# EAGLE design 362_MiniProj_FullBoard (EAGLE 7.5.0)
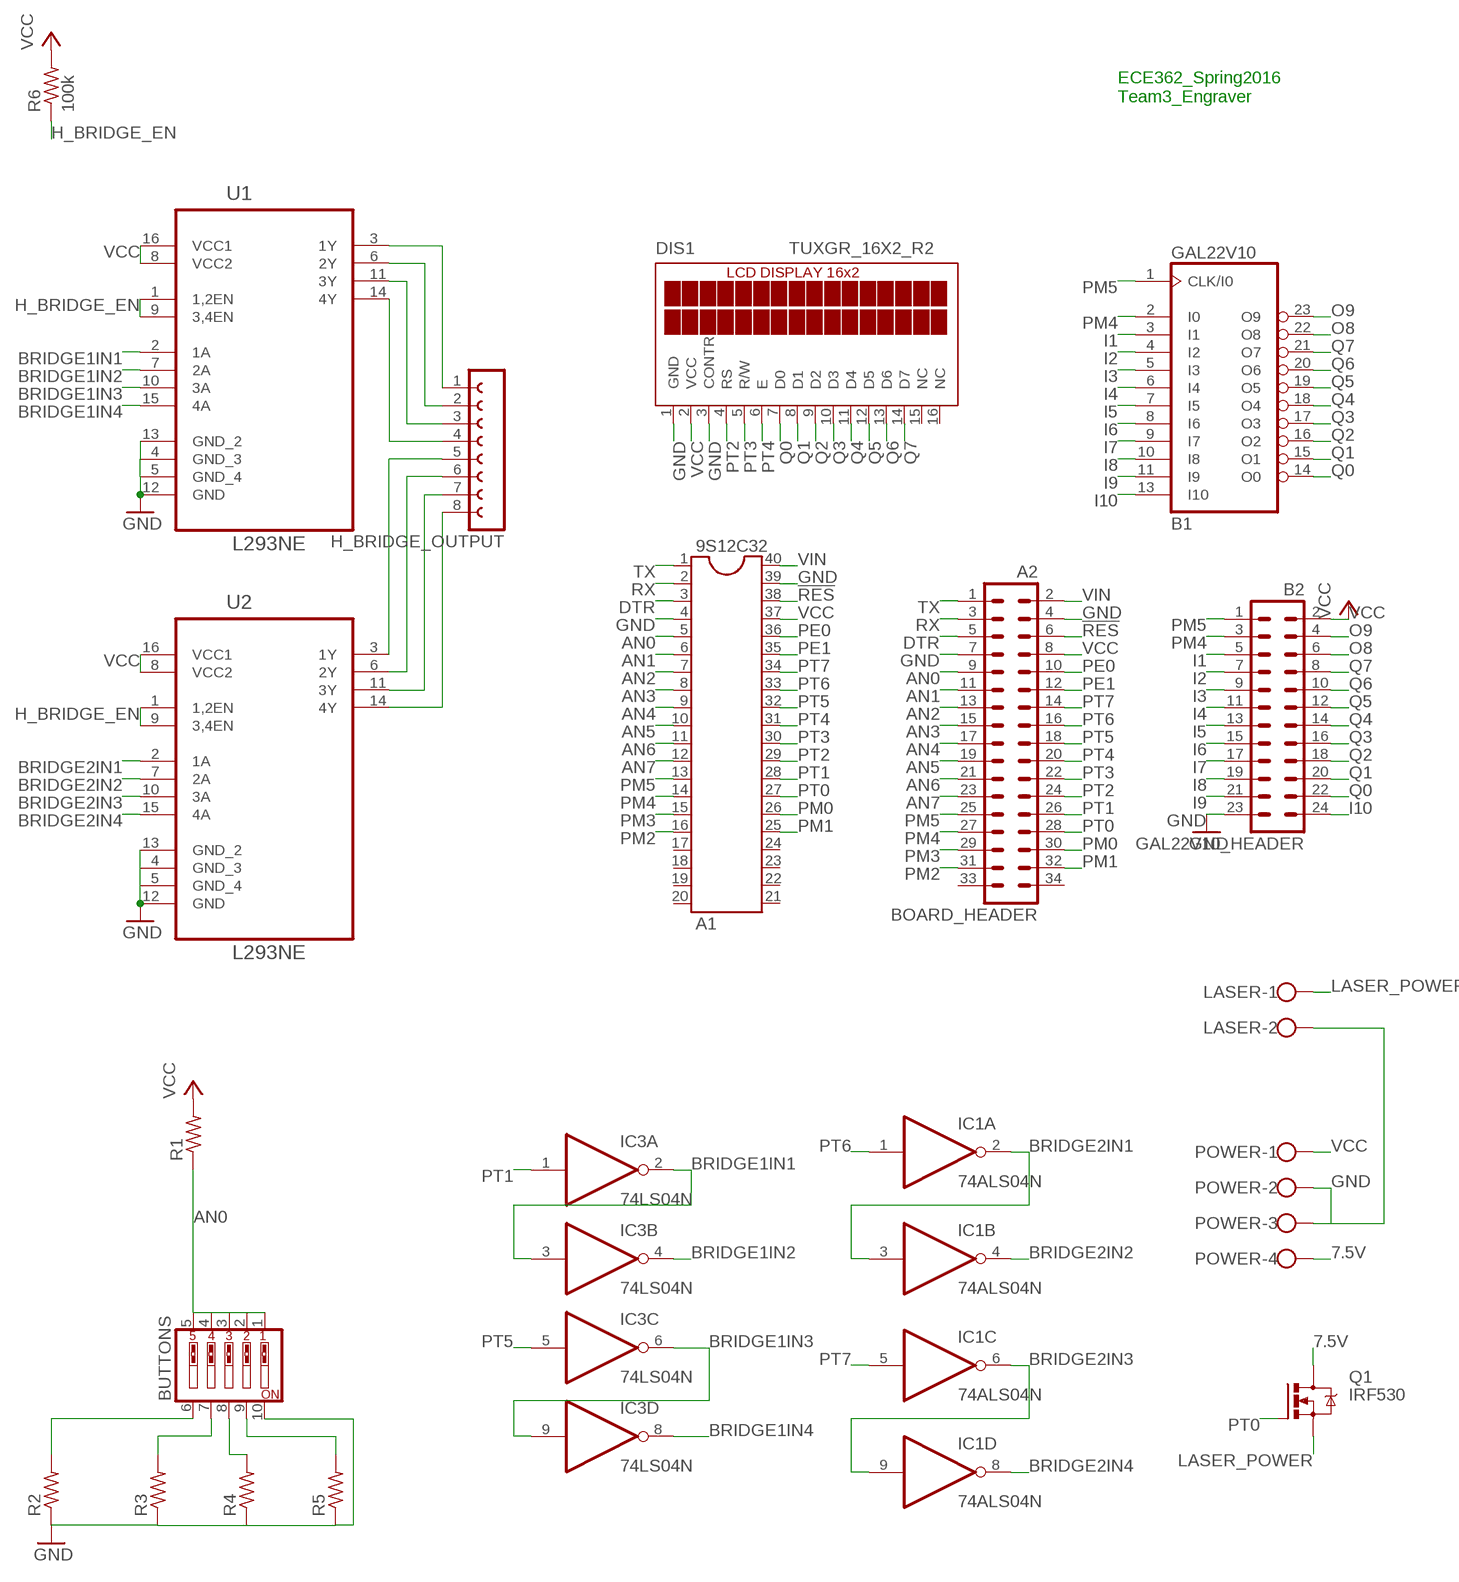
[diagram p0: schematic, sheet 1]

## Parts
9S12C32  A1  DIL40  [DIL40]
BOARD_HEADER  A2  MA17-2  [MA17-2]
BUTTONS  SW_DIP-5  [EDG-05]
DIS1  TUXGR_16X2_R2  [TUXGR_16X2_R2]
GAL22V10  B1  22V10  [DIL24-3]
GAL22V10_HEADER  B2  MA12-2  [MA12-2]
H_BRIDGE_OUTPUT  FE08-1  [FE08]
IC1  74ALS04N  [DIL14]
IC3  74LS04N  [DIL14]
LASER  W237-102  [W237-102]
POWER  W239-104  [W239-104]
Q1  IRF530  [TO220BV]
R1  R-US_0207/10  [0207/10]
R2  R-US_0207/10  [0207/10]
R3  R-US_0207/10  [0207/10]
R4  R-US_0207/10  [0207/10]
R5  R-US_0207/10  [0207/10]
R6  100k  R-US_0207/10  [0207/10]
U1  L293NE  [DIP254P762X508-16]
U2  L293NE  [DIP254P762X508-16]

## Nets
7.5V: POWER.4 Q1.D
!RES: 9S12C32.38 BOARD_HEADER.6
AN0: 9S12C32.5 BOARD_HEADER.9 BUTTONS.1 BUTTONS.2 BUTTONS.3 BUTTONS.4 BUTTONS.5 R1.1
AN1: 9S12C32.6 BOARD_HEADER.11
AN2: 9S12C32.7 BOARD_HEADER.13
AN3: 9S12C32.8 BOARD_HEADER.15
AN4: 9S12C32.9 BOARD_HEADER.17
AN5: 9S12C32.10 BOARD_HEADER.19
AN6: 9S12C32.11 BOARD_HEADER.21
AN7: 9S12C32.12 BOARD_HEADER.23
BRIDGE1IN1: IC3.2(A:O) IC3.3(B:I) U1.2(1A)
BRIDGE1IN2: IC3.4(B:O) U1.7(2A)
BRIDGE1IN3: IC3.6(C:O) IC3.9(D:I) U1.10(3A)
BRIDGE1IN4: IC3.8(D:O) U1.15(4A)
BRIDGE2IN1: IC1.2(A:O) IC1.3(B:I) U2.2(1A)
BRIDGE2IN2: IC1.4(B:O) U2.7(2A)
BRIDGE2IN3: IC1.6(C:O) IC1.9(D:I) U2.10(3A)
BRIDGE2IN4: IC1.8(D:O) U2.15(4A)
DTR: 9S12C32.3 BOARD_HEADER.5
GND: 9S12C32.4 9S12C32.39 BOARD_HEADER.4 BOARD_HEADER.7 BUTTONS.10 DIS1.1(GND) DIS1.3(CONTR) GAL22V10_HEADER.23 LASER.2 POWER.2 POWER.3 R2.1 R3.1 R4.1 R5.1 U1.4(GND_3) U1.5(GND_4) U1.12(GND) U1.13(GND_2) U2.4(GND_3) U2.5(GND_4) U2.12(GND) U2.13(GND_2)
H_BRIDGE_EN: R6.1 U1.1(1,2EN) U1.9(3,4EN) U2.1(1,2EN) U2.9(3,4EN)
I1: GAL22V10.3(I1) GAL22V10_HEADER.5
I2: GAL22V10.4(I2) GAL22V10_HEADER.7
I3: GAL22V10.5(I3) GAL22V10_HEADER.9
I4: GAL22V10.6(I4) GAL22V10_HEADER.11
I5: GAL22V10.7(I5) GAL22V10_HEADER.13
I6: GAL22V10.8(I6) GAL22V10_HEADER.15
I7: GAL22V10.9(I7) GAL22V10_HEADER.17
I8: GAL22V10.10(I8) GAL22V10_HEADER.19
I9: GAL22V10.11(I9) GAL22V10_HEADER.21
I10: GAL22V10.13(I10) GAL22V10_HEADER.24
LASER_POWER: LASER.1 Q1.S
N$1: BUTTONS.6 R2.2
N$2: BUTTONS.7 R3.2
N$3: BUTTONS.8 R4.2
N$4: BUTTONS.9 R5.2
N$13: H_BRIDGE_OUTPUT.4 U1.14(4Y)
N$14: H_BRIDGE_OUTPUT.3 U1.11(3Y)
N$15: H_BRIDGE_OUTPUT.2 U1.6(2Y)
N$16: H_BRIDGE_OUTPUT.1 U1.3(1Y)
N$17: H_BRIDGE_OUTPUT.5 U2.3(1Y)
N$18: H_BRIDGE_OUTPUT.6 U2.6(2Y)
N$19: H_BRIDGE_OUTPUT.7 U2.11(3Y)
N$20: H_BRIDGE_OUTPUT.8 U2.14(4Y)
O8: GAL22V10.22(O8) GAL22V10_HEADER.6
O9: GAL22V10.23(O9) GAL22V10_HEADER.4
PE0: 9S12C32.36 BOARD_HEADER.10
PE1: 9S12C32.35 BOARD_HEADER.12
PM0: 9S12C32.26 BOARD_HEADER.30
PM1: 9S12C32.25 BOARD_HEADER.32
PM2: 9S12C32.16 BOARD_HEADER.31
PM3: 9S12C32.15 BOARD_HEADER.29
PM4: 9S12C32.14 BOARD_HEADER.27 GAL22V10.2(I0) GAL22V10_HEADER.3
PM5: 9S12C32.13 BOARD_HEADER.25 GAL22V10.1(CLK/I0) GAL22V10_HEADER.1
PT0: 9S12C32.27 BOARD_HEADER.28 Q1.G
PT1: 9S12C32.28 BOARD_HEADER.26 IC3.1(A:I)
PT2: 9S12C32.29 BOARD_HEADER.24 DIS1.4(RS)
PT3: 9S12C32.30 BOARD_HEADER.22 DIS1.5(R/W)
PT4: 9S12C32.31 BOARD_HEADER.20 DIS1.6(E)
PT5: 9S12C32.32 BOARD_HEADER.18 IC3.5(C:I)
PT6: 9S12C32.33 BOARD_HEADER.16 IC1.1(A:I)
PT7: 9S12C32.34 BOARD_HEADER.14 IC1.5(C:I)
Q0: DIS1.7(D0) GAL22V10.14(O0) GAL22V10_HEADER.22
Q1: DIS1.8(D1) GAL22V10.15(O1) GAL22V10_HEADER.20
Q2: DIS1.9(D2) GAL22V10.16(O2) GAL22V10_HEADER.18
Q3: DIS1.10(D3) GAL22V10.17(O3) GAL22V10_HEADER.16
Q4: DIS1.11(D4) GAL22V10.18(O4) GAL22V10_HEADER.14
Q5: DIS1.12(D5) GAL22V10.19(O5) GAL22V10_HEADER.12
Q6: DIS1.13(D6) GAL22V10.20(O6) GAL22V10_HEADER.10
Q7: DIS1.14(D7) GAL22V10.21(O7) GAL22V10_HEADER.8
RX: 9S12C32.2 BOARD_HEADER.3
TX: 9S12C32.1 BOARD_HEADER.1
VCC: 9S12C32.37 BOARD_HEADER.8 DIS1.2(VCC) GAL22V10_HEADER.2 POWER.1 R1.2 R6.2 U1.8(VCC2) U1.16(VCC1) U2.8(VCC2) U2.16(VCC1)
VIN: 9S12C32.40 BOARD_HEADER.2
Unconnected: 9S12C32.17 9S12C32.18 9S12C32.19 9S12C32.20 9S12C32.21 9S12C32.22 9S12C32.23 9S12C32.24 BOARD_HEADER.33 BOARD_HEADER.34 DIS1.15(NC) DIS1.16(NC) IC1.10(E:O) IC1.11(E:I) IC1.12(F:O) IC1.13(F:I) IC3.10(E:O) IC3.11(E:I) IC3.12(F:O) IC3.13(F:I)

## Notes on the sheet
- ECE362_Spring2016
  Team3_Engraver

## Power pins joined to a net without a drawn wire
GND: GAL22V10.12(GND) IC1.7(P:GND) IC3.7(P:GND)
VCC: GAL22V10.24(VCC) IC1.14(P:VCC) IC3.14(P:VCC)

## Library data of the parts
9S12C32 = ic-package:DIL40: Dual In Line
BOARD_HEADER = con-lstb:MA17-2: PIN HEADER; OC_FARNELL: unknown; OC_NEWARK: unknown
BUTTONS = special:SW_DIP-5: DIP SWITCH
DIS1 = display-lcd:TUXGR_16X2_R2: Tuxgraphics LCD display 16x2 characters reflective, without background light Source: tuxgr_12x2_r2.pdf; OC_FARNELL: unknown; OC_NEWARK: unknown
GAL22V10 = pal:22V10: PAL; MPN: GAL22V10D-7LPN; OC_FARNELL: 1571925; OC_NEWARK: 97M0480
GAL22V10_HEADER = con-lstb:MA12-2: PIN HEADER; OC_FARNELL: unknown; OC_NEWARK: unknown
H_BRIDGE_OUTPUT = con-lsta:FE08-1: FEMALE HEADER; OC_FARNELL: unknown; OC_NEWARK: unknown
IC1 = 74xx-eu:74*04: Hex INVERTER
IC3 = 74xx-us:74*04: Hex INVERTER
LASER = con-wago-500:W237-102: WAGO SCREW CLAMP; MPN: 237-102; OC_FARNELL: unknown; OC_NEWARK: 70K9898
POWER = con-wago-500:W239-104: WAGO SCREW CLAMP; OC_FARNELL: unknown; OC_NEWARK: unknown
Q1 = transistor-power:IRF530: HEXFET Power MOSFET
R1-R6 = resistor:R-US_: RESISTOR, American symbol
U1 U2 = Texas Instruments_By_element14_Batch_1:L293NE: QUADRUPLE HALF-H DRIVERS; MPN: L293NE; OC_FARNELL: -; OC_NEWARK: 06F9524; PACKAGE: PDIP-16; SUPPLIER: Texas Instruments

## Board
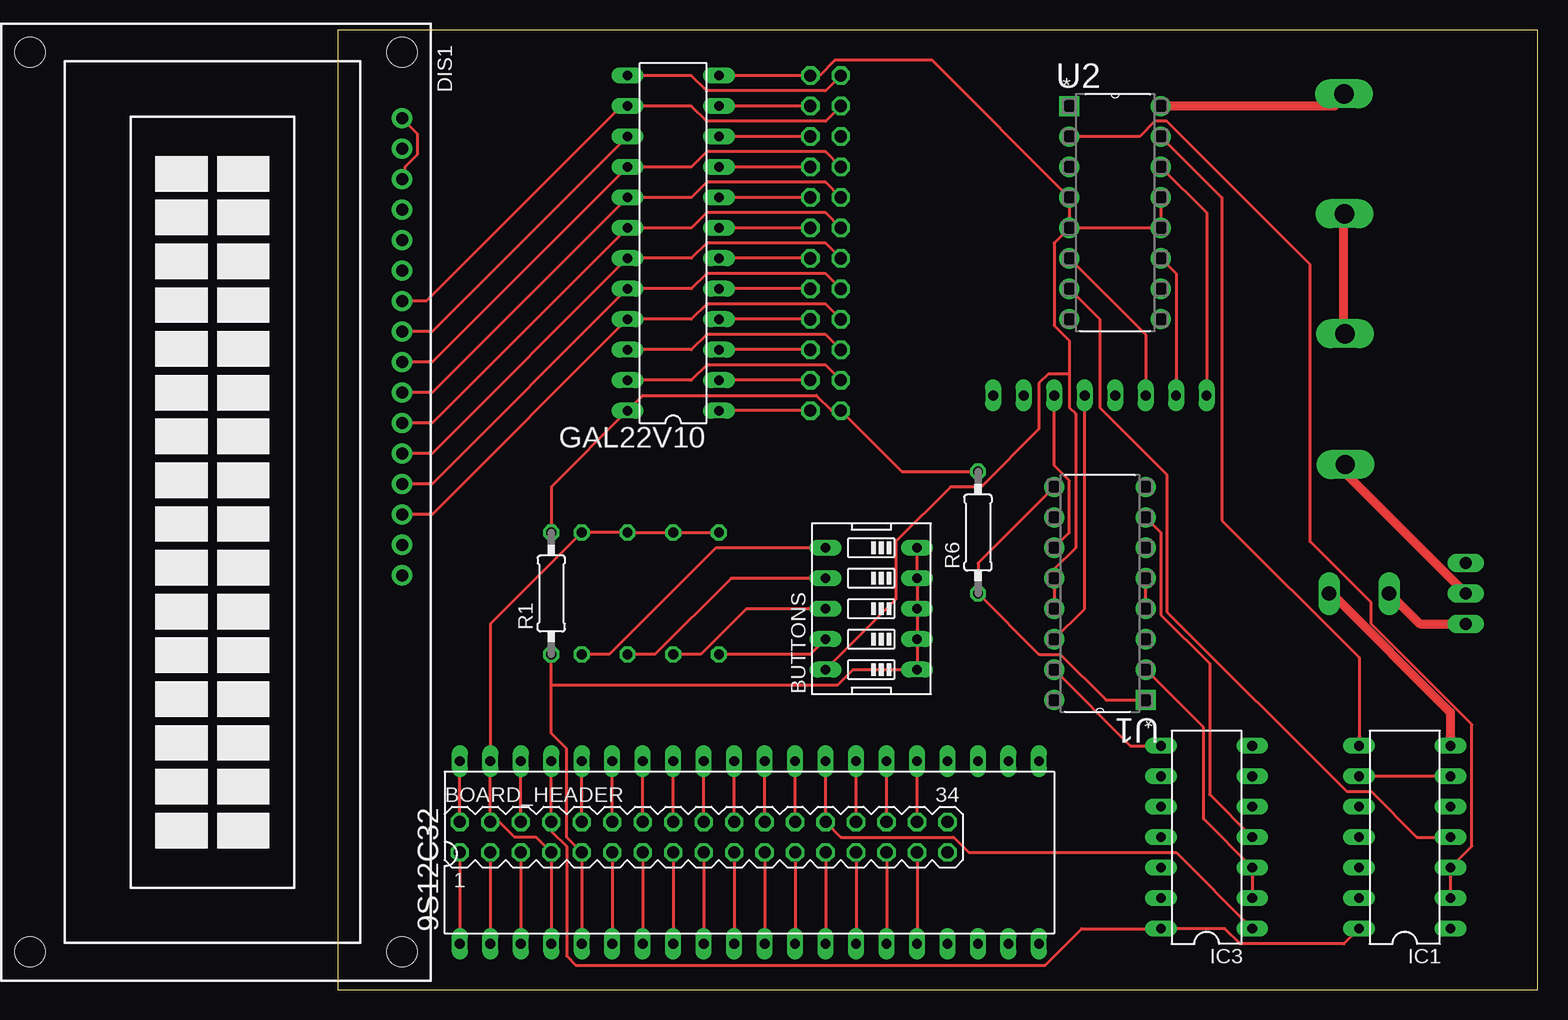
[diagram p1: board, top side]
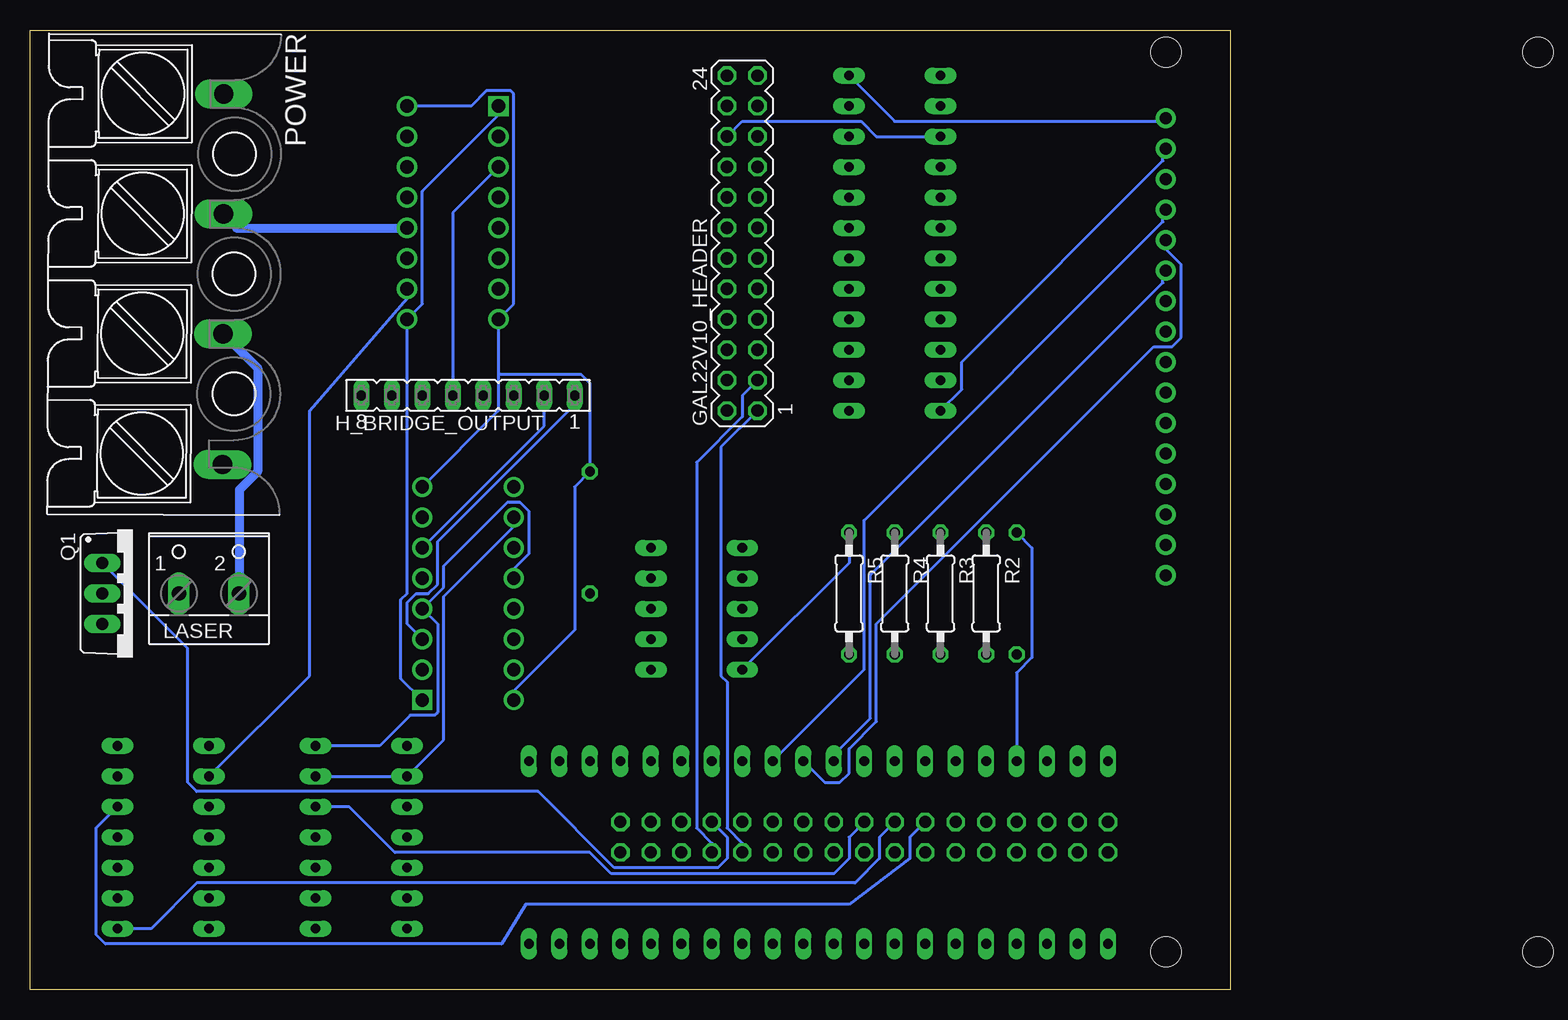
[diagram p2: board, bottom side, seen from below]

Size 100 x 80 mm. Coordinates in mm from the lower left corner, seen from the top.
Outline: 0,0 100,0 100,80 0,80 0,0
Copper layers (1*16): Top 0.035mm / dielectric 1.5mm / Bottom 0.035mm
Design rules "default *": minimum track width 10mil, minimum drill 24mil, track to track 10mil, track to pad 10mil, pad to pad 10mil, via to via 10mil, smd to smd 8mil, copper to edge 40mil, drill to drill 8mil, minimum pad ring 10mil, minimum via ring 8mil, stop-mask expansion 4mil, vias tented up to drill 0mil, thermal gap 10mil

### Footprints (pad centres in the part's own frame; a part is rotated, then mirrored left to right if it is on the bottom)
DIL40 = drill 0.813 long: 1 -24.13,-7.62; 2 -21.59,-7.62; 3 -19.05,-7.62; 4 -16.51,-7.62; 5 -13.97,-7.62; 6 -11.43,-7.62; 7 -8.89,-7.62; 8 -6.35,-7.62; 9 -3.81,-7.62; 10 -1.27,-7.62; 11 1.27,-7.62; 12 3.81,-7.62; 13 6.35,-7.62; 14 8.89,-7.62; 15 11.43,-7.62; 16 13.97,-7.62; 17 16.51,-7.62; 18 19.05,-7.62; 19 21.59,-7.62; 20 24.13,-7.62; 21 24.13,7.62; 22 21.59,7.62; 23 19.05,7.62; 24 16.51,7.62; 25 13.97,7.62; 26 11.43,7.62; 27 8.89,7.62; 28 6.35,7.62; 29 3.81,7.62; 30 1.27,7.62; 31 -1.27,7.62; 32 -3.81,7.62; 33 -6.35,7.62; 34 -8.89,7.62; 35 -11.43,7.62; 36 -13.97,7.62; 37 -16.51,7.62; 38 -19.05,7.62; 39 -21.59,7.62; 40 -24.13,7.62
MA17-2 = drill 1.016 octagon: 1 -20.32,-1.27; 2 -20.32,1.27; 3 -17.78,-1.27; 4 -17.78,1.27; 5 -15.24,-1.27; 6 -15.24,1.27; 7 -12.7,-1.27; 8 -12.7,1.27; 9 -10.16,-1.27; 10 -10.16,1.27; 11 -7.62,-1.27; 12 -7.62,1.27; 13 -5.08,-1.27; 14 -5.08,1.27; 15 -2.54,-1.27; 16 -2.54,1.27; 17 0,-1.27; 18 0,1.27; 19 2.54,-1.27; 20 2.54,1.27; 21 5.08,-1.27; 22 5.08,1.27; 23 7.62,-1.27; 24 7.62,1.27; 25 10.16,-1.27; 26 10.16,1.27; 27 12.7,-1.27; 28 12.7,1.27; 29 15.24,-1.27; 30 15.24,1.27; 31 17.78,-1.27; 32 17.78,1.27; 33 20.32,-1.27; 34 20.32,1.27
EDG-05 = drill 0.813 long: 1 -5.08,-3.81; 2 -2.54,-3.81; 3 0,-3.81; 4 2.54,-3.81; 5 5.08,-3.81; 6 5.08,3.81; 7 2.54,3.81; 8 0,3.81; 9 -2.54,3.81; 10 -5.08,3.81
TUXGR_16X2_R2 = drill 1 pad 1.676: 1 -32,15.5; 2 -29.46,15.5; 3 -26.92,15.5; 4 -24.38,15.5; 5 -21.84,15.5; 6 -19.3,15.5; 7 -16.76,15.5; 8 -14.22,15.5; 9 -11.68,15.5; 10 -9.14,15.5; 11 -6.6,15.5; 12 -4.06,15.5; 13 -1.52,15.5; 14 1.02,15.5; 15 3.56,15.5; 16 6.1,15.5 | hole 2.5: -37.5,-15.5; 37.5,-15.5; -37.5,15.5; 37.5,15.5
DIL24-3 = drill 0.813 long: 1 -13.97,-3.81; 2 -11.43,-3.81; 3 -8.89,-3.81; 4 -6.35,-3.81; 5 -3.81,-3.81; 6 -1.27,-3.81; 7 1.27,-3.81; 8 3.81,-3.81; 9 6.35,-3.81; 10 8.89,-3.81; 11 11.43,-3.81; 12 13.97,-3.81; 13 13.97,3.81; 14 11.43,3.81; 15 8.89,3.81; 16 6.35,3.81; 17 3.81,3.81; 18 1.27,3.81; 19 -1.27,3.81; 20 -3.81,3.81; 21 -6.35,3.81; 22 -8.89,3.81; 23 -11.43,3.81; 24 -13.97,3.81
MA12-2 = drill 1.016 octagon: 1 -13.97,-1.27; 2 -13.97,1.27; 3 -11.43,-1.27; 4 -11.43,1.27; 5 -8.89,-1.27; 6 -8.89,1.27; 7 -6.35,-1.27; 8 -6.35,1.27; 9 -3.81,-1.27; 10 -3.81,1.27; 11 -1.27,-1.27; 12 -1.27,1.27; 13 1.27,-1.27; 14 1.27,1.27; 15 3.81,-1.27; 16 3.81,1.27; 17 6.35,-1.27; 18 6.35,1.27; 19 8.89,-1.27; 20 8.89,1.27; 21 11.43,-1.27; 22 11.43,1.27; 23 13.97,-1.27; 24 13.97,1.27
FE08 = drill 0.813 long: 1 -8.89,0; 2 -6.35,0; 3 -3.81,0; 4 -1.27,0; 5 1.27,0; 6 3.81,0; 7 6.35,0; 8 8.89,0
DIL14 = drill 0.813 long: 1 -7.62,-3.81; 2 -5.08,-3.81; 3 -2.54,-3.81; 4 0,-3.81; 5 2.54,-3.81; 6 5.08,-3.81; 7 7.62,-3.81; 8 7.62,3.81; 9 5.08,3.81; 10 2.54,3.81; 11 0,3.81; 12 -2.54,3.81; 13 -5.08,3.81; 14 -7.62,3.81
W237-102 = drill 1.194 long: 1 -2.5,-1.27; 2 2.5,-1.27
W239-104 = drill 1.6 long: 1 -15,5; 2 -5,5; 3 5,5; 4 15.9,5
TO220BV = drill 1.016 long: D 0,-2.54; G -2.54,-2.54; S 2.54,-2.54
0207/10 = drill 0.813 octagon: 1 -5.08,0; 2 5.08,0
DIP254P762X508-16 = drill 1.118 square: 1 -7.62,17.78 | drill 1.118: 2 -7.62,15.24; 3 -7.62,12.7; 4 -7.62,10.16; 5 -7.62,7.62; 6 -7.62,5.08; 7 -7.62,2.54; 8 -7.62,0; 9 0,0; 10 0,2.54; 11 0,5.08; 12 0,7.62; 13 0,10.16; 14 0,12.7; 15 0,15.24; 16 0,17.78

### Placement (x,y rotation side)
9S12C32  34.29,11.43 0 top
BOARD_HEADER  30.48,12.7 0 top
BUTTONS  44.45,31.75 90 top
DIS1  -10.16,40.64 270 top
GAL22V10  27.94,62.23 90 top
GAL22V10_HEADER  40.64,62.23 90 bottom
H_BRIDGE_OUTPUT  63.5,49.53 180 bottom
IC1  88.9,12.7 90 top
IC3  72.39,12.7 90 top
LASER  85.09,34.29 0 bottom
POWER  88.9,59.69 269.8 bottom
Q1  91.44,33.02 270 bottom
R1  17.78,33.02 90 top
R2  20.32,33.02 270 bottom
R3  24.13,33.02 270 bottom
R4  27.94,33.02 270 bottom
R5  31.75,33.02 270 bottom
R6  53.34,38.1 90 top
U1  59.69,41.91 180 top
U2  68.58,55.88 0 top

### Tracks (layer width: path | path; a pad name or v marks a point on that pad's centre or on a via)
7.5V
  Top 0.254: 84.07,42.93 84.07,43.69 POWER.4
  Top 0.762: 84.07,42.93 Q1.D
!RES
  Top 0.254: BOARD_HEADER.6 9S12C32.38
AN0
  Top 0.254: BUTTONS.5 BUTTONS.4 BUTTONS.3 BUTTONS.2 BUTTONS.1 42.93,26.67 41.66,25.4 17.78,25.4 | 17.78,25.4 17.78,21.34 19.05,20.07 19.05,12.7 BOARD_HEADER.9 9S12C32.5 | 17.78,25.4 R1.1
AN1
  Top 0.254: BOARD_HEADER.11 9S12C32.6
AN2
  Top 0.254: BOARD_HEADER.13 9S12C32.7
AN3
  Top 0.254: BOARD_HEADER.15 9S12C32.8
AN4
  Top 0.254: BOARD_HEADER.17 9S12C32.9
AN5
  Top 0.254: BOARD_HEADER.19 9S12C32.10
AN6
  Top 0.254: BOARD_HEADER.21 9S12C32.11
AN7
  Top 0.254: BOARD_HEADER.23 9S12C32.12
BRIDGE1IN1
  Top 0.254: IC3.2 IC3.3 72.14,14.22 72.14,21.84 U1.2
BRIDGE1IN2
  Top 0.254: IC3.4 72.64,16.26 72.64,27.18 68.58,31.24 68.58,38.1 U1.7
BRIDGE1IN3
  Bottom 0.254: IC3.6 IC3.9 65.53,20.83 65.53,32.77 59.69,38.61 U1.10
BRIDGE1IN4
  Top 0.254: IC3.8 66.04,20.32 U1.15
BRIDGE2IN1
  Top 0.254: IC1.2 IC1.3 94.49,11.94 94.49,22.1 86.11,30.48 86.11,32.26 81.03,37.34 81.03,60.45 69.09,72.39 68.07,72.39 66.8,71.12 U2.2
BRIDGE2IN2
  Top 0.254: IC1.4 89.92,12.7 86.11,16.51 84.07,16.51 69.09,31.5 69.09,42.93 63.5,48.51 63.5,55.88 U2.7
BRIDGE2IN3
  Top 0.254: IC1.6 IC1.9
  Bottom 0.254: U2.10 68.58,57.66 76.71,48.26 76.71,26.16 IC1.9
BRIDGE2IN4
  Top 0.254: IC1.8 85.09,27.69 73.66,39.12 73.66,66.04 U2.15
DTR
  Top 0.254: BOARD_HEADER.5 9S12C32.3
GND
  Top 0.254: 9S12C32.4 BOARD_HEADER.7 16.51,12.7 14.73,12.7 13.46,13.97 BOARD_HEADER.4 9S12C32.39 12.7,30.48 R2.1 R3.1 R4.1 R5.1 | DIS1.3 5.59,67.56 5.59,68.58 6.6,69.6 6.6,71.37 5.59,72.39 DIS1.1 | GAL22V10.12 GAL22V10_HEADER.23 40.13,76.2 41.4,77.47 49.53,77.47 U2.4 U2.5 | U1.13 U1.12 59.69,35.05 61.47,36.83 61.47,48.01 60.96,48.51 60.96,51.31 | U1.4 U1.5 | 82.8,33.02 LASER.2 | U2.13 U2.12 U2.5 | 83.82,64.52 POWER.2 | 83.82,54.86 POWER.3 | 60.96,51.31 60.96,54.1 59.69,55.37 59.69,62.23 U2.5 | BUTTONS.10 46.48,32.51 46.48,37.34 51.05,41.91 53.59,41.91 58.42,46.74 58.42,50.55 59.18,51.31 60.96,51.31
  Top 0.762: IC1.7 92.71,23.11 82.8,33.02 | 83.82,54.86 83.82,64.52
  Bottom 0.254: BUTTONS.10 31.75,35.56 R5.1 | GAL22V10.12 27.94,72.39 5.59,72.39 DIS1.1 | IC3.7 70.87,20.32 68.33,22.86 66.29,22.86 66.04,23.11 66.04,30.48 U1.4 65.53,33.53 65.53,35.31 60.2,40.64 59.18,40.64 58.42,39.88 58.42,36.32 59.69,35.05 U1.12 | 82.8,63.5 83.82,64.52 POWER.2 | 82.55,33.02 LASER.2 | 83.82,54.61 POWER.3
  Bottom 0.762: 82.8,63.5 U2.12 | 82.55,33.02 82.55,41.66 81.03,43.18 81.03,51.82 83.82,54.61
H_BRIDGE_EN
  Top 0.254: U1.9 53.34,35.56 R6.1 58.42,27.94 60.2,27.94 64.01,24.13 U1.1
  Bottom 0.254: U2.1 60.96,72.9 67.31,66.55 67.31,57.15 U2.9 68.58,33.02 69.09,32.51 69.09,25.91 U1.1
I1
  Top 0.254: GAL22V10_HEADER.5 GAL22V10.3
I2
  Top 0.254: GAL22V10_HEADER.7 GAL22V10.4
I3
  Top 0.254: GAL22V10_HEADER.9 GAL22V10.5
I4
  Top 0.254: GAL22V10_HEADER.11 GAL22V10.6
I5
  Top 0.254: GAL22V10_HEADER.13 GAL22V10.7
I6
  Top 0.254: GAL22V10_HEADER.15 GAL22V10.8
I7
  Top 0.254: GAL22V10_HEADER.17 GAL22V10.9
I8
  Top 0.254: GAL22V10_HEADER.19 GAL22V10.10
I9
  Top 0.254: GAL22V10_HEADER.21 GAL22V10.11
I10
  Top 0.254: GAL22V10.13 29.46,76.2 30.73,74.93 40.64,74.93 GAL22V10_HEADER.24
LASER_POWER
  Top 0.254: 87.63,33.02 LASER.1
  Top 0.762: Q1.S 90.17,30.48 87.63,33.02
N$1
  Top 0.254: R2.2 22.61,27.94 31.5,36.83 BUTTONS.6
N$2
  Top 0.254: R3.2 26.42,27.94 32.77,34.29 BUTTONS.7
N$3
  Top 0.254: R4.2 30.23,27.94 34.04,31.75 BUTTONS.8
N$4
  Top 0.254: R5.2 39.37,27.94 BUTTONS.9
N$13
  Top 0.254: H_BRIDGE_OUTPUT.4 62.23,31.75 U1.14
N$14
  Top 0.254: H_BRIDGE_OUTPUT.3 59.69,43.69 60.96,42.42 60.96,38.1 U1.11
N$15
  Bottom 0.254: H_BRIDGE_OUTPUT.2 57.15,46.99 U1.6
N$16
  Bottom 0.254: H_BRIDGE_OUTPUT.1 54.61,48.77 66.04,37.34 66.04,33.78 66.8,33.02 67.82,33.02 68.58,32.26 68.58,30.48 U1.3
N$17
  Bottom 0.254: H_BRIDGE_OUTPUT.5 64.77,64.77 U2.3
N$18
  Top 0.254: H_BRIDGE_OUTPUT.6 67.31,54.61 U2.6
N$19
  Top 0.254: H_BRIDGE_OUTPUT.7 69.85,59.69 U2.11
N$20
  Top 0.254: H_BRIDGE_OUTPUT.8 72.39,64.77 U2.14
O8
  Top 0.254: GAL22V10.22 29.46,53.34 30.73,54.61 40.64,54.61 GAL22V10_HEADER.6
O9
  Top 0.254: GAL22V10.23 29.46,50.8 30.73,52.07 40.64,52.07 GAL22V10_HEADER.4
PE0
  Top 0.254: BOARD_HEADER.10 9S12C32.36
PE1
  Top 0.254: BOARD_HEADER.12 9S12C32.35
PM0
  Top 0.254: BOARD_HEADER.30 9S12C32.26
PM1
  Top 0.254: BOARD_HEADER.32 9S12C32.25
PM2
  Top 0.254: BOARD_HEADER.31 9S12C32.16
PM3
  Top 0.254: BOARD_HEADER.29 9S12C32.15
PM4
  Top 0.254: BOARD_HEADER.27 9S12C32.14 | GAL22V10_HEADER.3 GAL22V10.2
  Bottom 0.254: BOARD_HEADER.27 43.18,12.19 44.45,13.46 44.45,43.94 40.64,47.75 40.64,49.53 GAL22V10_HEADER.3
PM5
  Top 0.254: BOARD_HEADER.25 9S12C32.13 | GAL22V10_HEADER.1 GAL22V10.1
  Bottom 0.254: BOARD_HEADER.25 40.64,12.19 41.91,13.46 41.91,25.65 42.42,26.16 42.42,45.21 GAL22V10_HEADER.1
PT0
  Top 0.254: BOARD_HEADER.28 9S12C32.27
  Bottom 0.254: Q1.G 86.87,28.45 86.87,17.27 86.11,16.51 57.66,16.51 51.31,10.16 42.67,10.16 41.91,10.92 41.91,12.7 BOARD_HEADER.28
PT1
  Top 0.254: 9S12C32.28 BOARD_HEADER.26 41.91,12.7 51.31,12.7 52.58,11.43 69.85,11.43 IC3.1
PT2
  Top 0.254: BOARD_HEADER.24 9S12C32.29
  Bottom 0.254: 9S12C32.29 30.48,26.67 30.48,39.12 5.59,64.01 5.59,64.77 DIS1.4
PT3
  Top 0.254: BOARD_HEADER.22 9S12C32.30
  Bottom 0.254: 9S12C32.30 33.78,17.27 32.51,17.27 31.75,18.03 31.75,20.07 29.46,22.35 29.46,30.48 6.35,53.59 4.83,53.59 4.06,54.36 4.06,60.45 5.33,61.72 5.33,62.23 DIS1.5
PT4
  Top 0.254: BOARD_HEADER.20 9S12C32.31
  Bottom 0.254: 9S12C32.31 33.02,19.56 29.97,22.61 29.97,34.54 5.59,58.93 5.59,59.69 DIS1.6
PT5
  Top 0.254: BOARD_HEADER.18 9S12C32.32
  Bottom 0.254: IC3.5 73.41,15.24 69.6,11.43 53.34,11.43 51.56,9.65 33.02,9.65 31.75,10.92 31.75,12.7 BOARD_HEADER.18
PT6
  Top 0.254: BOARD_HEADER.16 9S12C32.33
  Bottom 0.254: IC1.1 89.92,5.08 86.11,8.89 31.24,8.89 29.21,10.92 29.21,12.7 BOARD_HEADER.16
PT7
  Top 0.254: BOARD_HEADER.14 9S12C32.34
  Bottom 0.254: IC1.5 94.49,13.46 94.49,4.57 93.73,3.81 60.71,3.81 58.67,7.11 31.75,7.11 26.67,10.92 26.67,12.7 BOARD_HEADER.14
Q0
  Top 0.254: GAL22V10_HEADER.22 40.64,72.39 30.73,72.39 29.46,73.66 GAL22V10.14 23.62,73.66 7.37,57.4 5.59,57.4 DIS1.7
Q1
  Top 0.254: GAL22V10.15 7.87,54.86 5.59,54.86 DIS1.8
  Bottom 0.254: GAL22V10.15 29.46,71.12 30.73,72.39 40.64,72.39 GAL22V10_HEADER.20
Q2
  Top 0.254: GAL22V10_HEADER.18 40.64,69.85 30.73,69.85 29.46,68.58 GAL22V10.16 7.87,52.32 5.59,52.32 DIS1.9
Q3
  Top 0.254: GAL22V10_HEADER.16 40.64,67.31 30.73,67.31 29.46,66.04 GAL22V10.17 7.87,49.78 5.59,49.78 DIS1.10
Q4
  Top 0.254: GAL22V10_HEADER.14 40.64,64.77 30.73,64.77 29.46,63.5 GAL22V10.18 7.87,47.24 5.59,47.24 DIS1.11
Q5
  Top 0.254: GAL22V10_HEADER.12 40.64,62.23 30.73,62.23 29.46,60.96 GAL22V10.19 7.87,44.7 5.59,44.7 DIS1.12
Q6
  Top 0.254: GAL22V10_HEADER.10 40.64,59.69 30.73,59.69 29.46,58.42 GAL22V10.20 7.87,42.16 5.59,42.16 DIS1.13
Q7
  Top 0.254: GAL22V10_HEADER.8 40.64,57.15 30.73,57.15 29.46,55.88 GAL22V10.21 7.87,39.62 5.59,39.62 DIS1.14
RX
  Top 0.254: BOARD_HEADER.3 9S12C32.2
TX
  Top 0.254: BOARD_HEADER.1 9S12C32.1
VCC
  Top 0.254: R6.2 46.99,43.18 GAL22V10_HEADER.2 41.15,48.26 39.88,49.53 25.4,49.53 GAL22V10.24 17.78,41.91 R1.2 | 83.06,73.66 83.82,74.42 POWER.1 | IC1.14 83.82,3.81 75.18,3.81 73.91,5.08 IC3.14 61.98,5.08 58.93,2.03 19.81,2.03 19.05,2.79 19.05,11.94 17.78,13.21 BOARD_HEADER.8 9S12C32.37
  Top 0.762: 83.06,73.66 U2.16
  Bottom 0.254: U1.16 59.69,24.89 54.61,29.97 54.61,41.91 R6.2 53.34,50.55 54.1,51.31 60.96,51.31 | U1.8 60.96,48.26 60.96,51.31 | 60.96,51.31 U2.8 59.69,57.15 59.69,74.68 59.94,74.93 61.98,74.93 63.25,73.66 U2.16 | GAL22V10.24 22.35,50.04 22.35,52.32 5.59,69.09 5.59,69.85 DIS1.2 | 9S12C32.37 17.78,26.42 16.51,27.69 16.51,36.83 R1.2
VIN
  Top 0.254: BOARD_HEADER.2 9S12C32.40